# EAGLE schematic calculator4 (EAGLE 9.6.2)

## Sheet 1 of 2
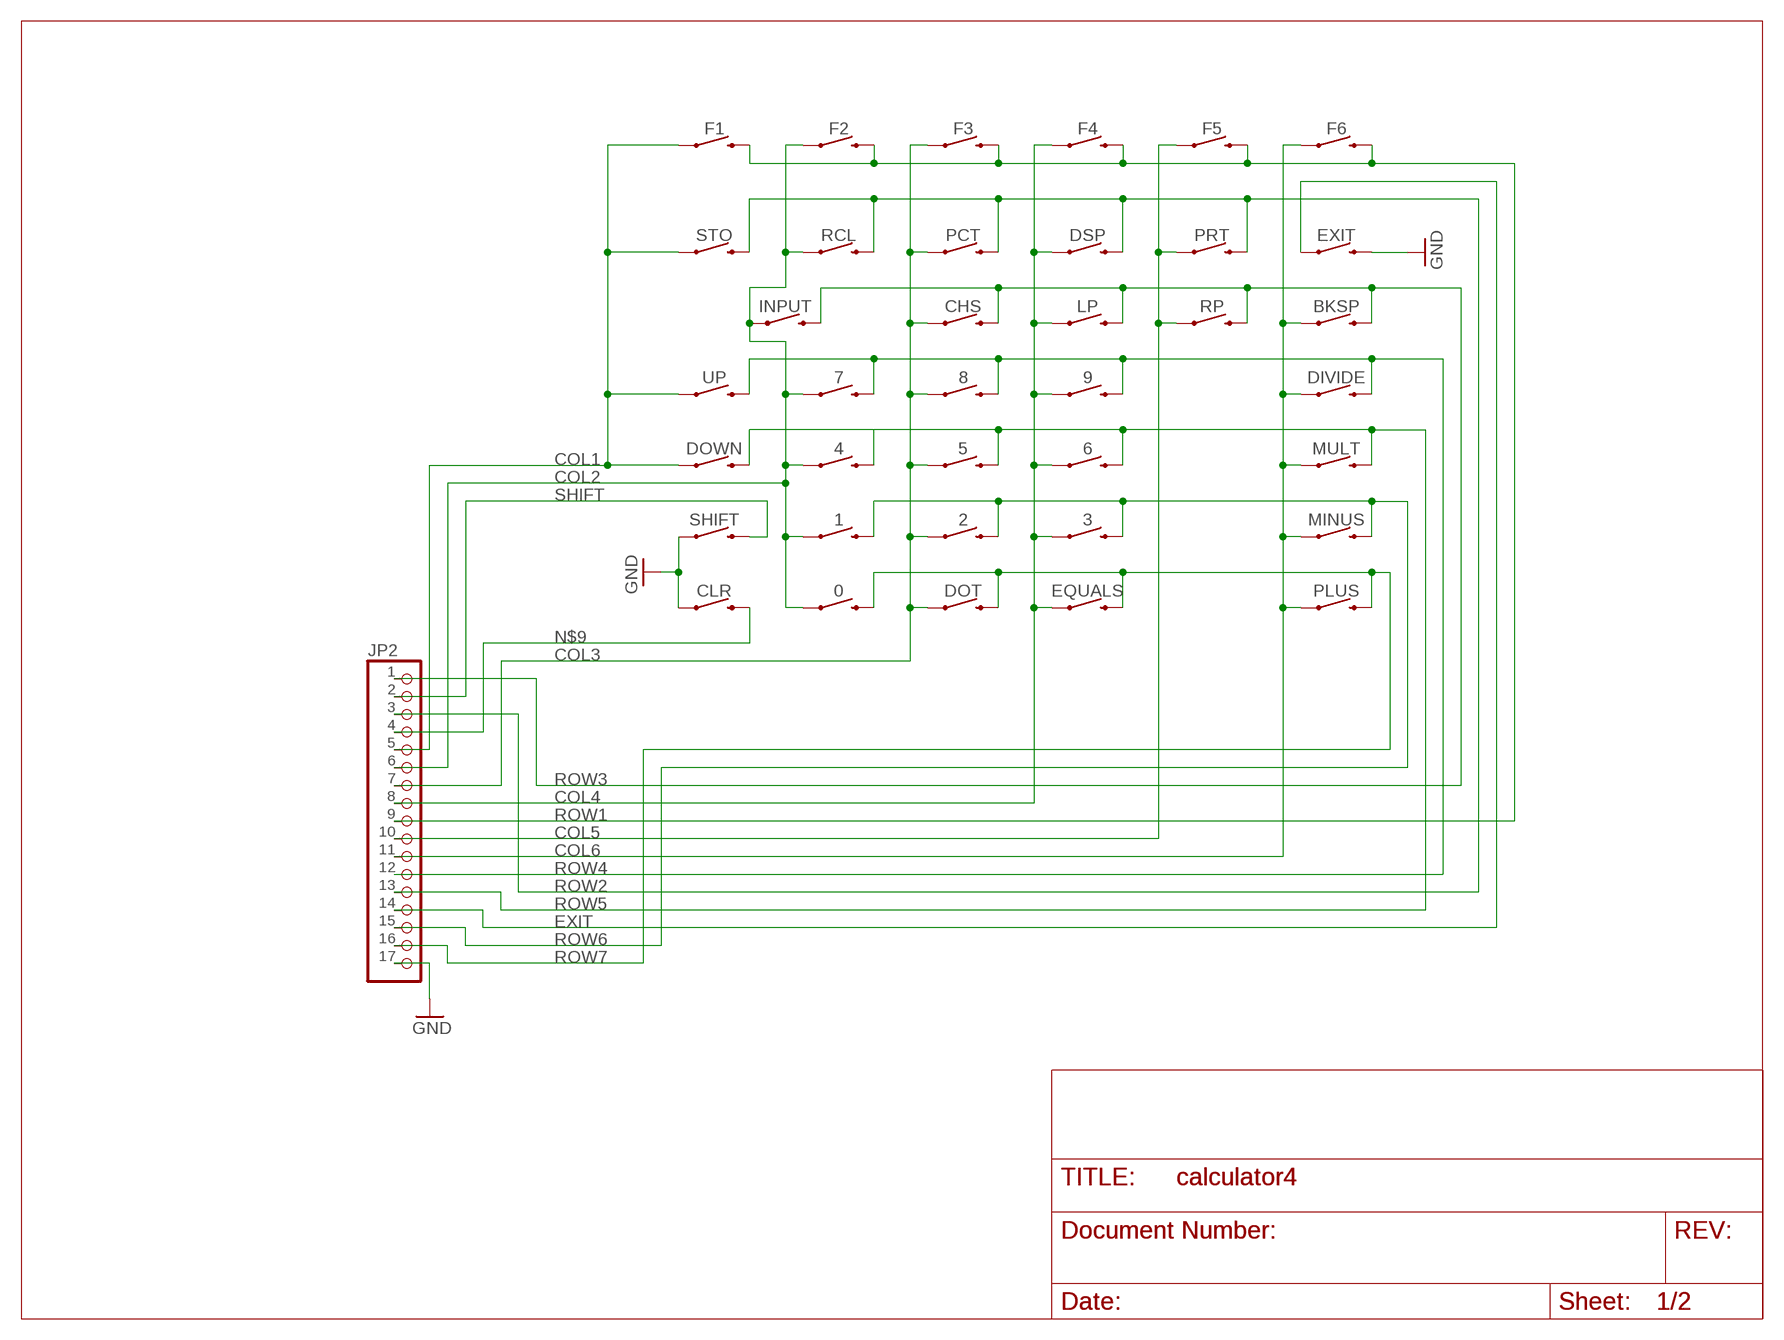
[diagram p0: schematic, sheet 1]

### Parts
0  BUTTON  [BUTTON]
1  BUTTON  [BUTTON]
2  BUTTON  [BUTTON]
3  BUTTON  [BUTTON]
4  BUTTON  [BUTTON]
5  BUTTON  [BUTTON]
6  BUTTON  [BUTTON]
7  BUTTON  [BUTTON]
8  BUTTON  [BUTTON]
9  BUTTON  [BUTTON]
BKSP  BUTTON  [BUTTON]
CHS  BUTTON  [BUTTON]
CLR  BUTTON  [BUTTON]
DIVIDE  BUTTON  [BUTTON]
DOT  BUTTON  [BUTTON]
DOWN  BUTTON  [BUTTON]
DSP  BUTTON  [BUTTON]
EQUALS  BUTTON  [BUTTON]
EXIT  BUTTON  [BUTTON]
F1  BUTTON  [BUTTON]
F2  BUTTON  [BUTTON]
F3  BUTTON  [BUTTON]
F4  BUTTON  [BUTTON]
F5  BUTTON  [BUTTON]
F6  BUTTON  [BUTTON]
INPUT  BUTTON  [BUTTON]
JP2  PINHD-1X17/90  [1X17/90]
LP  BUTTON  [BUTTON]
MINUS  BUTTON  [BUTTON]
MULT  BUTTON  [BUTTON]
PCT  BUTTON  [BUTTON]
PLUS  BUTTON  [BUTTON]
PRT  BUTTON  [BUTTON]
RCL  BUTTON  [BUTTON]
RP  BUTTON  [BUTTON]
SHIFT  BUTTON  [BUTTON]
STO  BUTTON  [BUTTON]
UP  BUTTON  [BUTTON]

### Nets
COL1: DOWN.1 F1.1 JP2.5 STO.1 UP.1
COL2: 0.1 1.1 4.1 7.1 F2.1 INPUT.1 JP2.6 RCL.1
COL3: 2.1 5.1 8.1 CHS.1 DOT.1 F3.1 JP2.7 PCT.1
COL4: 3.1 6.1 9.1 DSP.1 EQUALS.1 F4.1 JP2.8 LP.1
COL5: F5.1 JP2.10 PRT.1 RP.1
COL6: BKSP.1 DIVIDE.1 F6.1 JP2.11 MINUS.1 MULT.1 PLUS.1
EXIT: EXIT.1 JP2.14
GND: CLR.1 EXIT.3 JP2.17 SHIFT.1 ; also sheet 2
N$9: CLR.3 JP2.4
ROW1: F1.3 F2.3 F3.3 F4.3 F5.3 F6.3 JP2.9
ROW2: DSP.3 JP2.3 PCT.3 PRT.3 RCL.3 STO.3
ROW3: BKSP.3 CHS.3 INPUT.3 JP2.1 LP.3 RP.3
ROW4: 7.3 8.3 9.3 DIVIDE.3 JP2.12 UP.3
ROW5: 4.3 5.3 6.3 DOWN.3 JP2.13 MULT.3
ROW6: 1.3 2.3 3.3 JP2.15 MINUS.3
ROW7: 0.3 DOT.3 EQUALS.3 JP2.16 PLUS.3
SHIFT: JP2.2 SHIFT.3

## Sheet 2 of 2
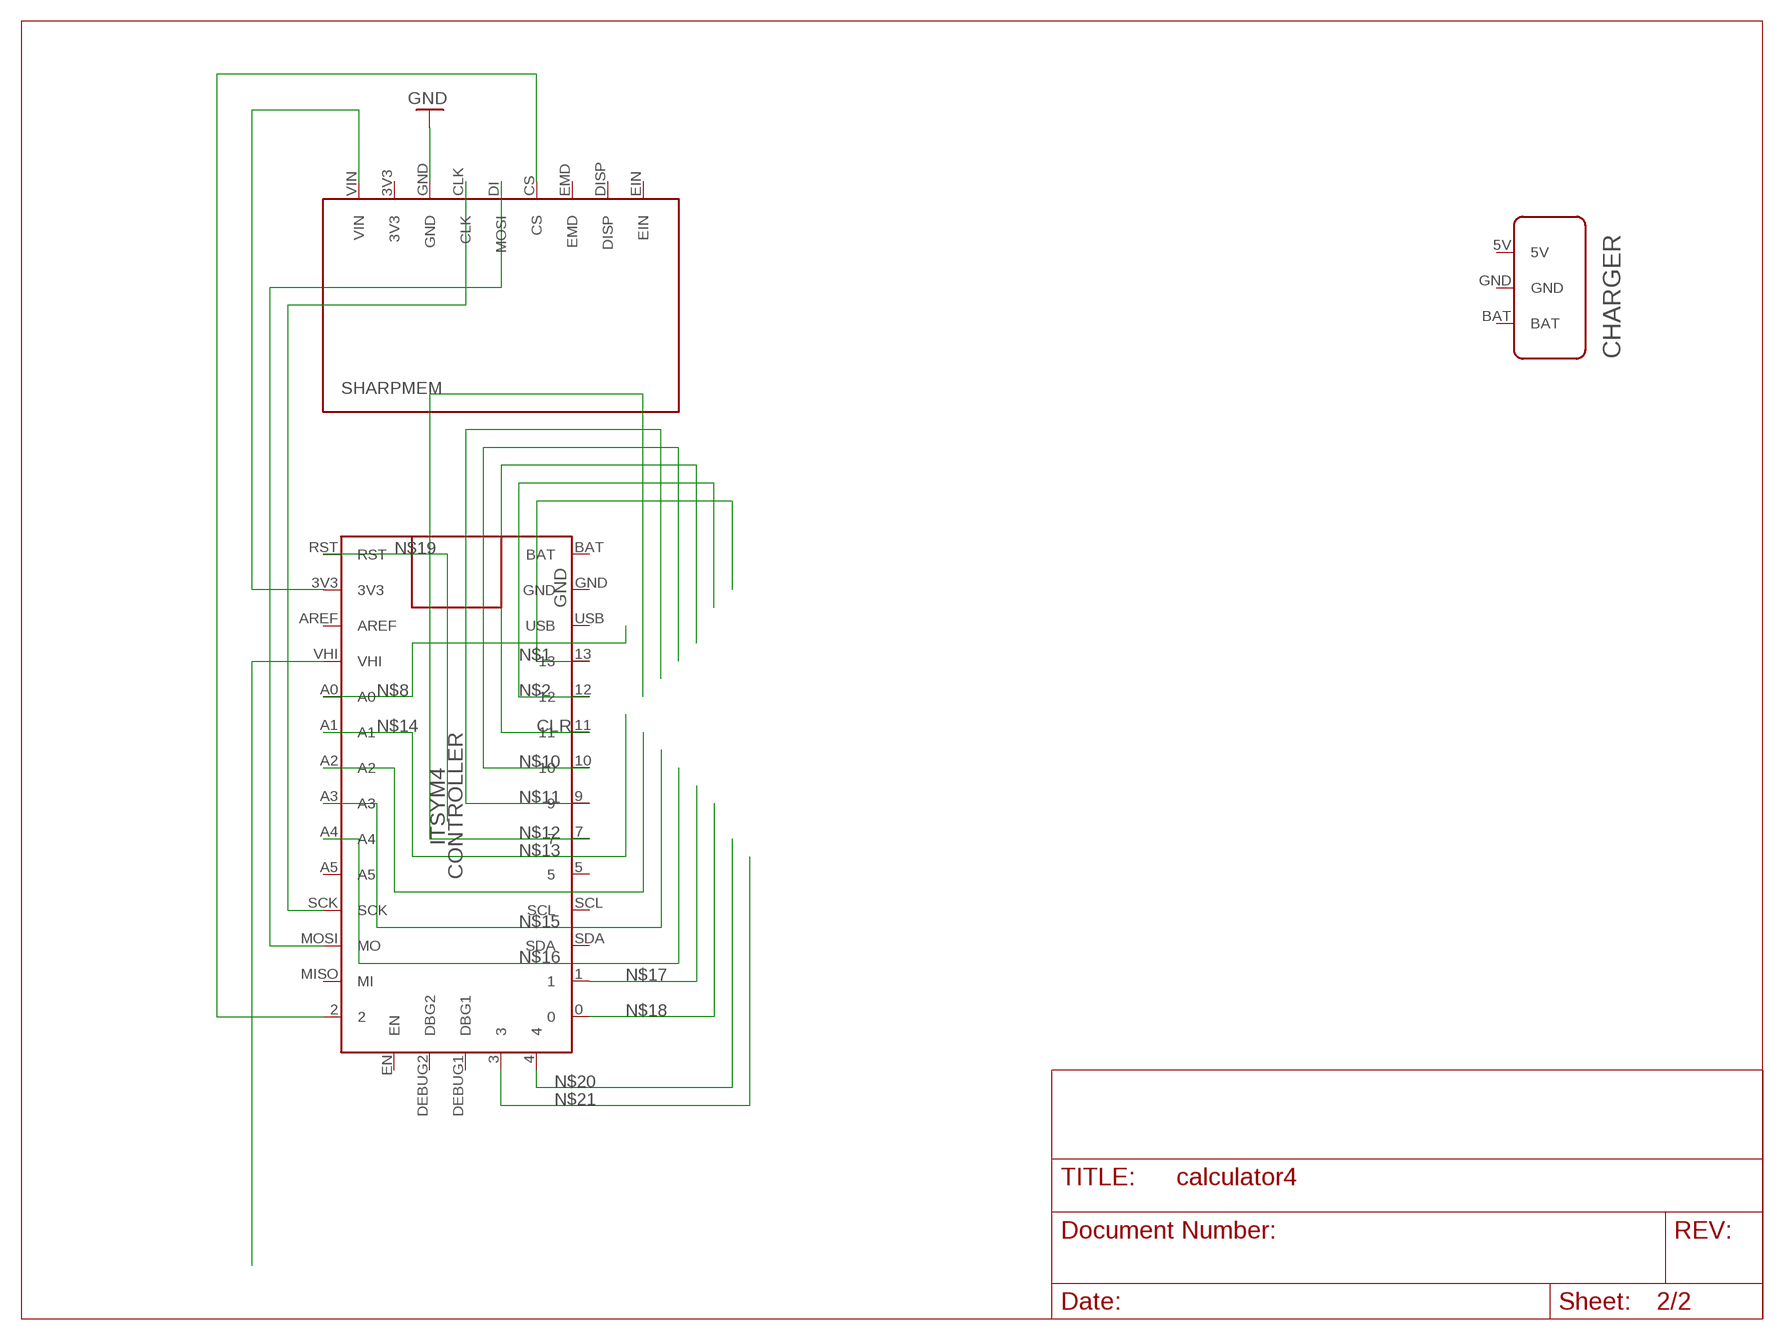
[diagram p1: schematic, sheet 2]

### Parts
CHARGER  LIPO_BACKPACK  [LIPO_BACKPACK]
CONTROLLER  ITSYM4  [ITSYM4]
SHARPMEM  SHARPMEM  [SHARPMEM]

### Nets
CLR: CONTROLLER.11
GND: CONTROLLER.GND SHARPMEM.GND ; also sheet 1
N$1: CONTROLLER.13
N$2: CONTROLLER.12
N$3: CONTROLLER.VHI
N$4: CONTROLLER.3V3 SHARPMEM.VIN
N$5: CONTROLLER.MOSI(MO) SHARPMEM.DI(MOSI)
N$6: CONTROLLER.SCK SHARPMEM.CLK
N$7: CONTROLLER.2 SHARPMEM.CS
N$8: CONTROLLER.A0
N$10: CONTROLLER.10
N$11: CONTROLLER.9
N$12: CONTROLLER.7
N$13: CONTROLLER.A1
N$14: CONTROLLER.A2
N$15: CONTROLLER.A3
N$16: CONTROLLER.A4
N$17: CONTROLLER.1
N$18: CONTROLLER.0
N$19: CONTROLLER.RST
N$20: CONTROLLER.4
N$21: CONTROLLER.3
Unconnected: CHARGER.5V CHARGER.BAT CHARGER.GND CONTROLLER.5 CONTROLLER.A5 CONTROLLER.AREF CONTROLLER.BAT CONTROLLER.DEBUG1(DBG1) CONTROLLER.DEBUG2(DBG2) CONTROLLER.EN CONTROLLER.MISO(MI) CONTROLLER.SCL CONTROLLER.SDA CONTROLLER.USB SHARPMEM.3V3 SHARPMEM.DISP SHARPMEM.EIN SHARPMEM.EMD

## Library data of the parts
0 1-9 BKSP CHS CLR DIVIDE DOT DOWN DSP EQUALS EXIT F1-F6 INPUT LP MINUS MULT PCT PLUS PRT RCL RP SHIFT STO UP = aaa_pw:BUTTON
CHARGER = aaa_pw:LIPO_BACKPACK
CONTROLLER = aaa_pw:ITSYM4
JP2 = pinhead:PINHD-1X17: PIN HEADER
SHARPMEM = aaa_pw:SHARPMEM